# EAGLE schematic Light Cube (EAGLE 6.5.0)
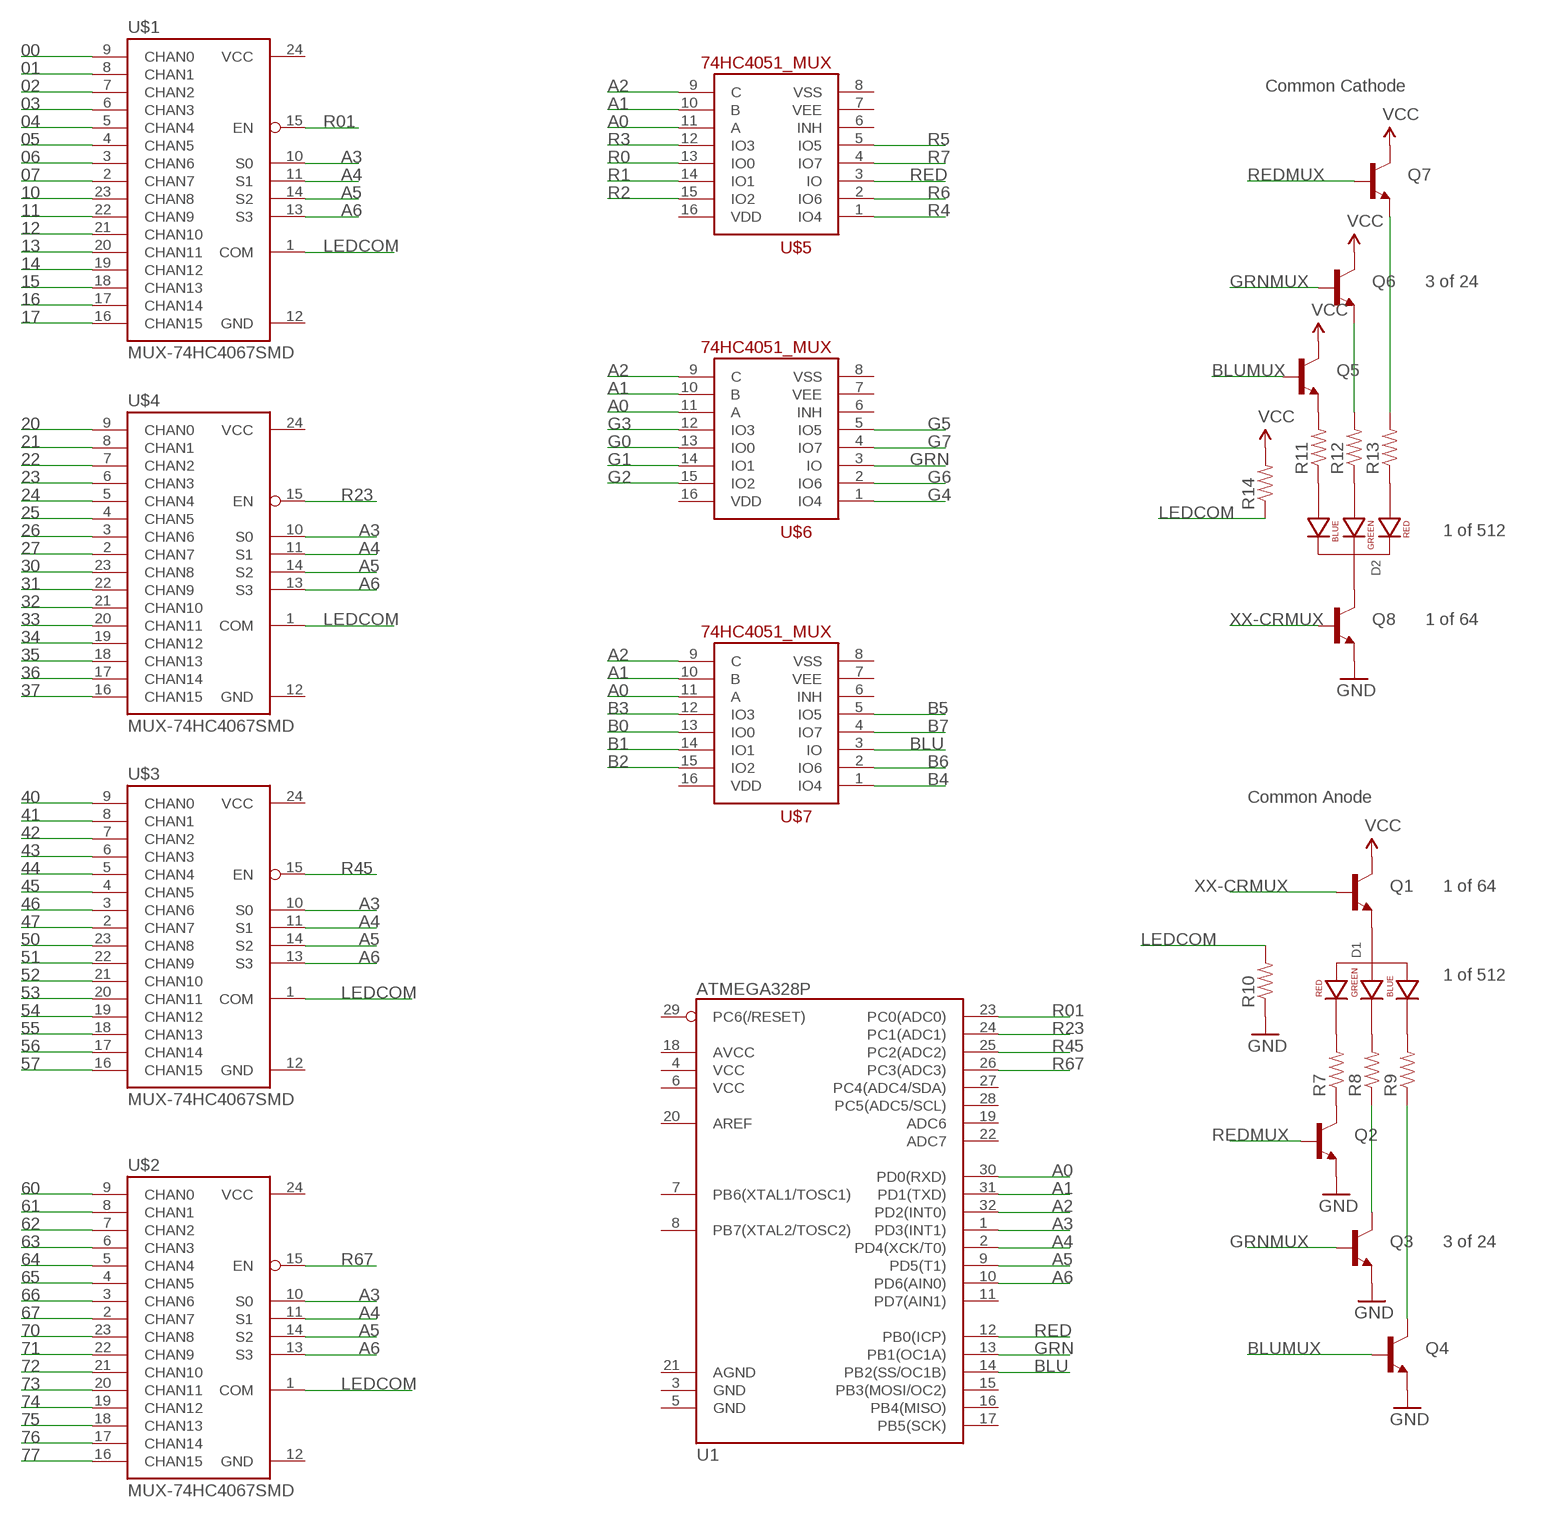
[diagram p0: schematic, sheet 1]

## Parts
D1  LED-RGB-CA-THRUCLEAR  [LED-RGB-THRU]
D2  LED-RGB-CC-THRUCLEAR  [LED-RGB-THRU]
Q1  TRANSISTOR_NPNTO92  [TO-92]
Q2  TRANSISTOR_NPNTO92  [TO-92]
Q3  TRANSISTOR_NPNTO92  [TO-92]
Q4  TRANSISTOR_NPNTO92  [TO-92]
Q5  TRANSISTOR_NPNTO92  [TO-92]
Q6  TRANSISTOR_NPNTO92  [TO-92]
Q7  TRANSISTOR_NPNTO92  [TO-92]
Q8  TRANSISTOR_NPNTO92  [TO-92]
R7  RESISTORPTH-1/4W  [AXIAL-0.4]
R8  RESISTORPTH-1/4W  [AXIAL-0.4]
R9  RESISTORPTH-1/4W  [AXIAL-0.4]
R10  RESISTORPTH-1/4W  [AXIAL-0.4]
R11  RESISTORPTH-1/4W  [AXIAL-0.4]
R12  RESISTORPTH-1/4W  [AXIAL-0.4]
R13  RESISTORPTH-1/4W  [AXIAL-0.4]
R14  RESISTORPTH-1/4W  [AXIAL-0.4]
U1  ATMEGA328P  ATMEGA328_SMT  [TQFP32-08]
U$1  MUX-74HC4067SMD  [SSOP24]
U$2  MUX-74HC4067SMD  [SSOP24]
U$3  MUX-74HC4067SMD  [SSOP24]
U$4  MUX-74HC4067SMD  [SSOP24]
U$5  74HC4051_MUX  [SO16]
U$6  74HC4051_MUX  [SO16]
U$7  74HC4051_MUX  [SO16]

## Nets
00: U$1.9(CHAN0)
01: U$1.8(CHAN1)
02: U$1.7(CHAN2)
03: U$1.6(CHAN3)
04: U$1.5(CHAN4)
05: U$1.4(CHAN5)
06: U$1.3(CHAN6)
07: U$1.2(CHAN7)
10: U$1.23(CHAN8)
11: U$1.22(CHAN9)
12: U$1.21(CHAN10)
13: U$1.20(CHAN11)
14: U$1.19(CHAN12)
15: U$1.18(CHAN13)
16: U$1.17(CHAN14)
17: U$1.16(CHAN15)
20: U$4.9(CHAN0)
21: U$4.8(CHAN1)
22: U$4.7(CHAN2)
23: U$4.6(CHAN3)
24: U$4.5(CHAN4)
25: U$4.4(CHAN5)
26: U$4.3(CHAN6)
27: U$4.2(CHAN7)
30: U$4.23(CHAN8)
31: U$4.22(CHAN9)
32: U$4.21(CHAN10)
33: U$4.20(CHAN11)
34: U$4.19(CHAN12)
35: U$4.18(CHAN13)
36: U$4.17(CHAN14)
37: U$4.16(CHAN15)
40: U$3.9(CHAN0)
41: U$3.8(CHAN1)
42: U$3.7(CHAN2)
43: U$3.6(CHAN3)
44: U$3.5(CHAN4)
45: U$3.4(CHAN5)
46: U$3.3(CHAN6)
47: U$3.2(CHAN7)
50: U$3.23(CHAN8)
51: U$3.22(CHAN9)
52: U$3.21(CHAN10)
53: U$3.20(CHAN11)
54: U$3.19(CHAN12)
55: U$3.18(CHAN13)
56: U$3.17(CHAN14)
57: U$3.16(CHAN15)
60: U$2.9(CHAN0)
61: U$2.8(CHAN1)
62: U$2.7(CHAN2)
63: U$2.6(CHAN3)
64: U$2.5(CHAN4)
65: U$2.4(CHAN5)
66: U$2.3(CHAN6)
67: U$2.2(CHAN7)
70: U$2.23(CHAN8)
71: U$2.22(CHAN9)
72: U$2.21(CHAN10)
73: U$2.20(CHAN11)
74: U$2.19(CHAN12)
75: U$2.18(CHAN13)
76: U$2.17(CHAN14)
77: U$2.16(CHAN15)
A0: U1.30(PD0(RXD)) U$5.11(A) U$6.11(A) U$7.11(A)
A1: U1.31(PD1(TXD)) U$5.10(B) U$6.10(B) U$7.10(B)
A2: U1.32(PD2(INT0)) U$5.9(C) U$6.9(C) U$7.9(C)
A3: U1.1(PD3(INT1)) U$1.10(S0) U$2.10(S0) U$3.10(S0) U$4.10(S0)
A4: U1.2(PD4(XCK/T0)) U$1.11(S1) U$2.11(S1) U$3.11(S1) U$4.11(S1)
A5: U1.9(PD5(T1)) U$1.14(S2) U$2.14(S2) U$3.14(S2) U$4.14(S2)
A6: U1.10(PD6(AIN0)) U$1.13(S3) U$2.13(S3) U$3.13(S3) U$4.13(S3)
B0: U$7.13(IO0)
B1: U$7.14(IO1)
B2: U$7.15(IO2)
B3: U$7.12(IO3)
B4: U$7.1(IO4)
B5: U$7.5(IO5)
B6: U$7.2(IO6)
B7: U$7.4(IO7)
BLU: U1.14(PB2(SS/OC1B)) U$7.3(IO)
BLUMUX: Q4.2(B) Q5.2(B)
G0: U$6.13(IO0)
G1: U$6.14(IO1)
G2: U$6.15(IO2)
G3: U$6.12(IO3)
G4: U$6.1(IO4)
G5: U$6.5(IO5)
G6: U$6.2(IO6)
G7: U$6.4(IO7)
GND: Q2.1(E) Q3.1(E) Q4.1(E) Q8.1(E) R10.P$1
GRN: U1.13(PB1(OC1A)) U$6.3(IO)
GRNMUX: Q3.2(B) Q6.2(B)
LEDCOM: R10.P$2 R14.P$1 U$1.1(COM) U$2.1(COM) U$3.1(COM) U$4.1(COM)
N$1: D1.2(ANODE) Q1.1(E)
N$2: D1.3(GREEN_CATHODE) R8.P$2
N$3: D1.4(BLUE_CATHODE) R9.P$2
N$4: D1.1(RED_CATHODE) R7.P$2
N$7: Q2.3(C) R7.P$1
N$8: Q3.3(C) R8.P$1
N$9: Q4.3(C) R9.P$1
N$10: D2.2(CATHODE) Q8.3(C)
N$11: D2.4(BLUE_CATHODE) R11.P$1
N$12: D2.3(GREEN_CATHODE) R12.P$1
N$18: D2.1(RED_CATHODE) R13.P$1
N$19: Q7.1(E) R13.P$2
N$20: Q5.1(E) R11.P$2
N$21: Q6.1(E) R12.P$2
R0: U$5.13(IO0)
R1: U$5.14(IO1)
R01: U1.23(PC0(ADC0)) U$1.15(EN)
R2: U$5.15(IO2)
R3: U$5.12(IO3)
R4: U$5.1(IO4)
R5: U$5.5(IO5)
R6: U$5.2(IO6)
R7: U$5.4(IO7)
R23: U1.24(PC1(ADC1)) U$4.15(EN)
R45: U1.25(PC2(ADC2)) U$3.15(EN)
R67: U1.26(PC3(ADC3)) U$2.15(EN)
RED: U1.12(PB0(ICP)) U$5.3(IO)
REDMUX: Q2.2(B) Q7.2(B)
VCC: Q1.3(C) Q5.3(C) Q6.3(C) Q7.3(C) R14.P$2
XX-CRMUX: Q1.2(B) Q8.2(B)
Unconnected: U1.3(GND) U1.4(VCC) U1.5(GND) U1.6(VCC) U1.7(PB6(XTAL1/TOSC1)) U1.8(PB7(XTAL2/TOSC2)) U1.11(PD7(AIN1)) U1.15(PB3(MOSI/OC2)) U1.16(PB4(MISO)) U1.17(PB5(SCK)) U1.18(AVCC) U1.19(ADC6) U1.20(AREF) U1.21(AGND) U1.22(ADC7) U1.27(PC4(ADC4/SDA)) U1.28(PC5(ADC5/SCL)) U1.29(PC6(/RESET)) U$1.12(GND) U$1.24(VCC) U$2.12(GND) U$2.24(VCC) U$3.12(GND) U$3.24(VCC) U$4.12(GND) U$4.24(VCC) U$5.6(INH) U$5.7(VEE) U$5.8(VSS) U$5.16(VDD) U$6.6(INH) U$6.7(VEE) U$6.8(VSS) U$6.16(VDD) U$7.6(INH) U$7.7(VEE) U$7.8(VSS) U$7.16(VDD)

## Notes on the sheet
- Common Cathode
- 3 of 24
- 1 of 512
- 1 of 64
- Common Anode
- 1 of 64
- 1 of 512
- 3 of 24

## Library data of the parts
D1 = SparkFun-LED:LED-RGB-CA-THRU: RGB Through-hole common anode SparkFun store front COM-10821 (diffuse) COM-10820 (clear); PROD_ID: DIO-10631
D2 = SparkFun-LED:LED-RGB-CC-THRU: RGB Through-hole common cathode LED SparkFun Storefront: COM-00105 (Clear) COM-09264 (Diffuse); PROD_ID: DIO-08418
Q1-Q8 = SparkFun-DiscreteSemi:TRANSISTOR_NPN: Generic NPN BJT MMBT2222A - TRANS-08049 (SOT-23, 1A 40V) MPSA42 - TRANS-09116 (SOT-23, 500mA 300V) MMBT5088LT1G - TRANS-11160 (SOT-23, 50 mA 30V)
R7-R14 = SparkFun-Resistors:RESISTOR: Resistor Basic schematic elements and footprints for 0603, 1206, and PTH resistors.
U1 = SparkFun-DigitalIC:ATMEGA328_SMT: 32-Pin Atmega328 part Commonly used on Arduino compatible boards Available in QFP and QFN packages TQFP is IC-09069 QFN is non-stock; PROD_ID: IC-09069
U$1-U$4 = SparkFun-AnalogIC:MUX-74HC4067: 16-channel analog MUX
U$5-U$7 = SparkFun-AnalogIC:74HC4051_MUX: 8:1 analog mux